# Altium project inv_pcb.PrjPcb
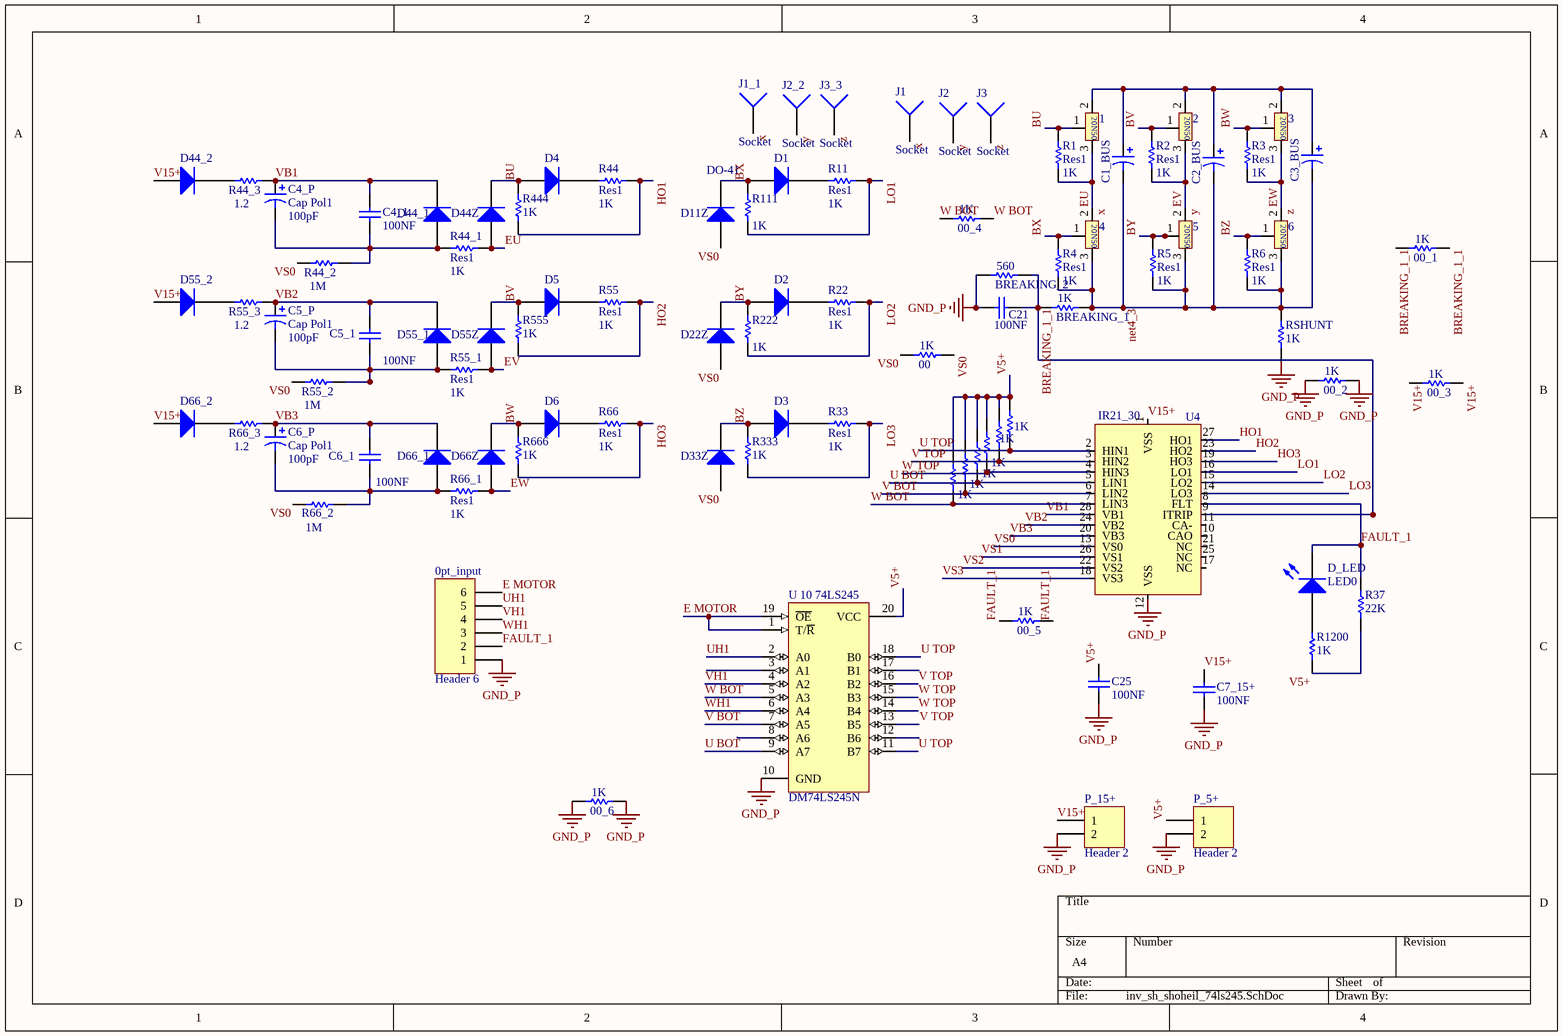
[diagram p0: inv_sh_shoheil_74ls245.SchDoc]
1 sheet, 93 parts. Net scope: global (net labels, ports and power ports of the same name join across sheets).
Board files: inv3ph.PcbDoc, PCB1_topoverly.PcbDoc

## Sheet inv_sh_shoheil_74ls245.SchDoc
size A4

### Parts
00  value 1K  [AXIAL-0.3]  (hidden comment: Res1)
00_1  value 1K  [AXIAL-0.3]  (hidden comment: Res1)
00_2  value 1K  [AXIAL-0.3]  (hidden comment: Res1)
00_3  value 1K  [AXIAL-0.3]  (hidden comment: Res1)
00_4  value 1K  [AXIAL-0.3]  (hidden comment: Res1)
00_5  value 1K  [AXIAL-0.3]  (hidden comment: Res1)
00_6  value 1K  [AXIAL-0.3]  (hidden comment: Res1)
0pt_input  Header 6  [HDR1X6]
1  igbt_20n50  [20N50_S]  (value not drawn)
2  igbt_20n50  [20N50_S]  (value not drawn)
3  igbt_20n50  [20N50_S]  (value not drawn)
4  igbt_20n50  [20N50_S]  (value not drawn)
5  igbt_20n50  [20N50_S]  (value not drawn)
6  igbt_20n50  [20N50_S]  (value not drawn)
BREAKING_1  value 1K  [AXIAL-0.5]  (hidden comment: Res1)
BREAKING_2  value 560  [AXIAL-0.5]  (hidden comment: Res1)
C1_BUS  Cap Pol1  [RB7.6-15]  (value not drawn)
C2_BUS  Cap Pol1  [RB7.6-15]  (value not drawn)
C3_BUS  Cap Pol1  [RB7.6-15]  (value not drawn)
C4_1  value 100NF  [C2B]  (hidden comment: Cap)
C4_P  Cap Pol1  value 100pF  [CE2]
C5_1  value 100NF  [C2B]  (hidden comment: Cap)
C5_P  Cap Pol1  value 100pF  [CE2]
C6_1  value 100NF  [C2B]  (hidden comment: Cap)
C6_P  Cap Pol1  value 100pF  [CE2]
C7_15+  value 100NF  [C2]  (hidden comment: Cap)
C21  value 100NF  [C2]  (hidden comment: Cap)
C25  value 100NF  [C2]  (hidden comment: Cap)
D1  Diode 1N4007  [DIO10.46-5.3x2.8]  (value not drawn)
D2  Diode 1N4007  [DIO10.46-5.3x2.8]  (value not drawn)
D3  Diode 1N4007  [DIO10.46-5.3x2.8]  (value not drawn)
D4  Diode 1N4007  [DIO10.46-5.3x2.8]  (value not drawn)
D5  Diode 1N4007  [DIO10.46-5.3x2.8]  (value not drawn)
D6  Diode 1N4007  [DIO10.46-5.3x2.8]  (value not drawn)
D11Z  PackageReference: DO-41  [DIO10.46-5.3x2.8]  (hidden comment: Diode 1N4007)
D22Z  Diode 1N4007  [DIO10.46-5.3x2.8]  (value not drawn)
D33Z  Diode 1N4007  [DIO10.46-5.3x2.8]  (value not drawn)
D44_1  Diode 1N4007  [DIO10.46-5.3x2.8]  (value not drawn)
D44_2  Diode 1N4007  [DIO10.46-5.3x2.8]  (value not drawn)
D44Z  Diode 1N4007  [DIO10.46-5.3x2.8]  (value not drawn)
D55_1  Diode 1N4007  [DIO10.46-5.3x2.8]  (value not drawn)
D55_2  Diode 1N4007  [DIO10.46-5.3x2.8]  (value not drawn)
D55Z  Diode 1N4007  [DIO10.46-5.3x2.8]  (value not drawn)
D66_1  Diode 1N4007  [DIO10.46-5.3x2.8]  (value not drawn)
D66_2  Diode 1N4007  [DIO10.46-5.3x2.8]  (value not drawn)
D66Z  Diode 1N4007  [DIO10.46-5.3x2.8]  (value not drawn)
D_LED  LED0  [CE5]
J1  Socket  [PIN1]
J1_1  Socket  [PIN1]
J2  Socket  [PIN1]
J2_2  Socket  [PIN1]
J3  Socket  [PIN1]
J3_3  Socket  [PIN1]
P_5+  Header 2  [HDR1X2]
P_15+  Header 2  [HDR1X2]
R1  Res1  value 1K  [AXIAL-0.3]
R2  Res1  value 1K  [AXIAL-0.3]
R3  Res1  value 1K  [AXIAL-0.3]
R4  Res1  value 1K  [AXIAL-0.3]
R5  Res1  value 1K  [AXIAL-0.3]
R6  Res1  value 1K  [AXIAL-0.3]
R11  Res1  value 1K  [AXIAL-0.3]
R22  Res1  value 1K  [AXIAL-0.3]
R33  Res1  value 1K  [AXIAL-0.3]
R37  value 22K  [AXIAL-0.3]  (hidden comment: Res1)
R44  Res1  value 1K  [AXIAL-0.3]
R44_1  Res1  value 1K  [AXIAL-0.3]
R44_2  value 1M  [AXIAL-0.3]  (hidden comment: Res1)
R44_3  value 1.2  [AXIAL-0.3]  (hidden comment: Res1)
R47_1  value 1K  [AXIAL-0.3]  (hidden comment: Res1)
R47_2  value 1K  [AXIAL-0.3]  (hidden comment: Res1)
R47_3  value 1K  [AXIAL-0.3]  (hidden comment: Res1)
R47_4  value 1K  [AXIAL-0.3]  (hidden comment: Res1)
R47_5  value 1K  [AXIAL-0.3]  (hidden comment: Res1)
R47_6  value 1K  [AXIAL-0.3]  (hidden comment: Res1)
R55  Res1  value 1K  [AXIAL-0.3]
R55_1  Res1  value 1K  [AXIAL-0.3]
R55_2  value 1M  [AXIAL-0.3]  (hidden comment: Res1)
R55_3  value 1.2  [AXIAL-0.3]  (hidden comment: Res1)
R66  Res1  value 1K  [AXIAL-0.3]
R66_1  Res1  value 1K  [AXIAL-0.3]
R66_2  value 1M  [AXIAL-0.3]  (hidden comment: Res1)
R66_3  value 1.2  [AXIAL-0.3]  (hidden comment: Res1)
R111  value 1K  [AXIAL-0.3]  (hidden comment: Res1)
R222  value 1K  [AXIAL-0.3]  (hidden comment: Res1)
R333  value 1K  [AXIAL-0.3]  (hidden comment: Res1)
R444  value 1K  [AXIAL-0.3]  (hidden comment: Res1)
R555  value 1K  [AXIAL-0.3]  (hidden comment: Res1)
R666  value 1K  [AXIAL-0.3]  (hidden comment: Res1)
R1200  value 1K  [AXIAL-0.3]  (hidden comment: Res1)
RSHUNT  value 1K  [AXIAL-1.0]  (hidden comment: Res1)
U4  IR21_30  [IR2130]
U_10_74LS245  DM74LS245N  [N20A]

### Nets
GND_P: 00_2.1 00_2.2 00_6.1 00_6.2 0pt_input.1 BREAKING_2.1 C7_15+.2 C21.2 C25.2 P_5+.2 P_15+.2 RSHUNT.1 U4.12(VSS) U_10_74LS245.10(GND)
BREAKING_1_1: 00_1.1 00_1.2 BREAKING_1.1 BREAKING_2.2 C21.1 U4.9(ITRIP)
BU: 1.1(G) D4.1(A) D44Z.2(K) R1.2 R444.2
BV: 2.1(G) D5.1(A) D55Z.2(K) R2.2 R555.2
BW: 3.1(G) D6.1(A) D66Z.2(K) R3.2 R666.2
BX: 4.1(G) D1.1(A) D11Z.2(K) R4.2 R111.2
BY: 5.1(G) D2.1(A) D22Z.2(K) R5.2 R222.2
BZ: 6.1(G) D3.1(A) D33Z.2(K) R6.2 R333.2
E MOTOR: 0pt_input.6 U_10_74LS245.1(T/~{R}) U_10_74LS245.19(~{OE})
EU: 1.3(E) 4.2(C) D44Z.1(A) J1.1 J1_1.1 R1.1 R44_1.2  [also labelled x]
EV: 2.3(E) 5.2(C) D55Z.1(A) J2.1 J2_2.1 R2.1 R55_1.2  [also labelled y]
EW: 3.3(E) 6.2(C) D66Z.1(A) J3.1 J3_3.1 R3.1 R66_1.2  [also labelled z]
FAULT_1: 00_5.1 00_5.2 0pt_input.2 D_LED.2(K) R37.2 U4.8(FLT)
HO1: R44.2 R444.1 U4.27(HO1)
HO2: R55.2 R555.1 U4.23(HO2)
HO3: R66.2 R666.1 U4.19(HO3)
LO1: R11.2 R111.1 U4.16(LO1)
LO2: R22.2 R222.1 U4.15(LO2)
LO3: R33.2 R333.1 U4.14(LO3)
net4_3: 4.3(E) 5.3(E) 6.3(E) BREAKING_1.2 C1_BUS.2 C2_BUS.2 C3_BUS.2 R4.1 R5.1 R6.1 RSHUNT.2
U BOT: R47_4.2 U4.5(LIN1) U_10_74LS245.9(A7)
U TOP: R47_1.2 U4.2(HIN1) U_10_74LS245.11(B7) U_10_74LS245.18(B0)
UH1: 0pt_input.5 U_10_74LS245.2(A0)
V5+: C25.1 P_5+.1 R37.1 R47_1.1 R47_2.1 R47_3.1 R47_4.1 R47_5.1 R47_6.1 R1200.1 U_10_74LS245.20(VCC)
V15+: 00_3.1 00_3.2 C7_15+.1 D44_2.1(A) D55_2.1(A) D66_2.1(A) P_15+.1 U4.1(VSS)
V BOT: R47_5.2 U4.6(LIN2) U_10_74LS245.7(A5)
V TOP: R47_2.2 U4.3(HIN2) U_10_74LS245.13(B5) U_10_74LS245.16(B2)
VB1: C4_1.2 C4_P.1 D44_1.2(K) R44_3.2 U4.28(VB1)
VB2: C5_1.2 C5_P.1 D55_1.2(K) R55_3.2 U4.24(VB2)
VB3: C6_1.2 C6_P.1 D66_1.2(K) R66_3.2 U4.20(VB3)
VH1: 0pt_input.4 U_10_74LS245.4(A2)
VS0: 00.1 00.2 D11Z.1(A) D22Z.1(A) D33Z.1(A) R44_2.1 R55_2.1 R66_2.1 U4.13(VS0)
VS1: U4.26(VS1)
VS2: U4.22(VS2)
VS3: U4.18(VS3)
W BOT: 00_4.1 00_4.2 R47_6.2 U4.7(LIN3) U_10_74LS245.5(A3)
W TOP: R47_3.2 U4.4(HIN3) U_10_74LS245.14(B4) U_10_74LS245.15(B3)
WH1: 0pt_input.3 U_10_74LS245.6(A4)
Net1_2: 1.2(C) 2.2(C) 3.2(C) C1_BUS.1 C2_BUS.1 C3_BUS.1
NetC4_1_1: C4_1.1 C4_P.2 D44_1.1(A) R44_1.1 R44_2.2
NetC5_1_1: C5_1.1 C5_P.2 D55_1.1(A) R55_1.1 R55_2.2
NetC6_1_1: C6_1.1 C6_P.2 D66_1.1(A) R66_1.1 R66_2.2
NetD1_2: D1.2(K) R11.1
NetD2_2: D2.2(K) R22.1
NetD3_2: D3.2(K) R33.1
NetD4_2: D4.2(K) R44.1
NetD5_2: D5.2(K) R55.1
NetD6_2: D6.2(K) R66.1
NetD44_2_2: D44_2.2(K) R44_3.1
NetD55_2_2: D55_2.2(K) R55_3.1
NetD66_2_2: D66_2.2(K) R66_3.1
NetD_LED_1: D_LED.1(A) R1200.2

Not connected (* = marked no-connect by the designer): U4 10(CAO) 11(CA-) 17(NC) 21(NC) 25(NC); U_10_74LS245 3(A1) 8(A6) 12(B6) 17(B1)

### Notes on the sheet
- (in symbol igbt_20n50) 20N50

### Library data of the parts
00 00_1-00_6 BREAKING_1 BREAKING_2 R1-R6 R11 R22 R33 R37 R44 R44_1-R44_3 R47_1-R47_6 R55 R55_1-R55_3 R66 R66_1-R66_3 R111 R222 R333 R444 R555 R666 R1200 RSHUNT = Res1: Resistor; Published: 8-Jun-2000; LatestRevisionDate: 17-Jul-2002; LatestRevisionNote: Re-released for DXP Platform.; PackageReference: AXIAL-0.3; Publisher: Altium Limited
0pt_input = Header 6: Header, 6-Pin; LatestRevisionDate: 17-Jul-2002; LatestRevisionNote: Re-released for DXP Platform.; Publisher: Altium Limited
C1_BUS C2_BUS C3_BUS = Cap Pol1: Polarized Capacitor (Radial); Value: 100pF; Published: 8-Jun-2000; LatestRevisionDate: 17-Jul-2002; LatestRevisionNote: Re-released for DXP Platform.; PackageReference: RB7.6-15; Publisher: Altium Limited
C4_1 C5_1 C6_1 C7_15+ C21 C25 = Cap: Capacitor; Published: 8-Jun-2000; LatestRevisionDate: 17-Jul-2002; LatestRevisionNote: Re-released for DXP Platform.; PackageReference: RAD-0.3; Publisher: Altium Limited
C4_P C5_P C6_P = Cap Pol1: Polarized Capacitor (Radial); Published: 8-Jun-2000; LatestRevisionDate: 17-Jul-2002; LatestRevisionNote: Re-released for DXP Platform.; PackageReference: RB7.6-15; Publisher: Altium Limited
D1-D6 D11Z D22Z D33Z D44_1 D44_2 D44Z D55_1 D55_2 D55Z D66_1 D66_2 D66Z = Diode 1N4007: 1 Amp General Purpose Rectifier; Published: 8-Jun-2000; LatestRevisionDate: 17-Jul-2002; LatestRevisionNote: Re-released for DXP Platform.; DatasheetVersion: 1998; PackageVersion: Aug-1999; Publisher: Altium Limited; Code_JEDEC: DO-204-AL; ComponentLink1Description: Manufacturer Link; ComponentLink1URL: http://www.fairchildsemi.com/; ComponentLink2Description: Datasheet; ComponentLink2URL: http://www.fairchildsemi.com/ds/1N%2F1N4001.pdf
  D1-D6 D22Z D33Z D44_1 D44_2 D44Z D55_1 D55_2 D55Z D66_1 D66_2 D66Z: PackageReference: DO-41
D_LED = LED0: Typical INFRARED GaAs LED; Published: 8-Jun-2000; LatestRevisionDate: 08-Jul-2005; LatestRevisionNote: Mech Layer 1 removed.; PackageReference: LED-0; Publisher: Altium Limited
P_5+ P_15+ = Header 2: Header, 2-Pin; LatestRevisionDate: 17-Jul-2002; LatestRevisionNote: Re-released for DXP Platform.; Publisher: Altium Limited
U_10_74LS245 = DM74LS245N: 3-State Octal Bus Transceiver; Published: 17-Jul-2002; LatestRevisionDate: 04-Mar-2005; LatestRevisionNote: Stylized 3D Model Added.; DatasheetVersion: Mar-1998; PackageVersion: 2000; PackageReference: N20A; Publisher: Altium Limited; PackageDescription: DIP; 20 Leads; Row Spacing 7.62 mm; Pitch 2.54 mm; Code_JEDEC: MS-001-AD; ComponentLink1Description: Manufacturer Link; ComponentLink1URL: http://www.fairchildsemi.com/
J1 J1_1 J2 J2_2 J3 J3_3 = Socket: LatestRevisionDate: 17-Jul-2002; LatestRevisionNote: Re-released for DXP Platform.; Publisher: Altium Limited